# Altium schematic sheet Microcontroller.SchDoc
size A4; SheetNumber: 2; SheetTotal: 5
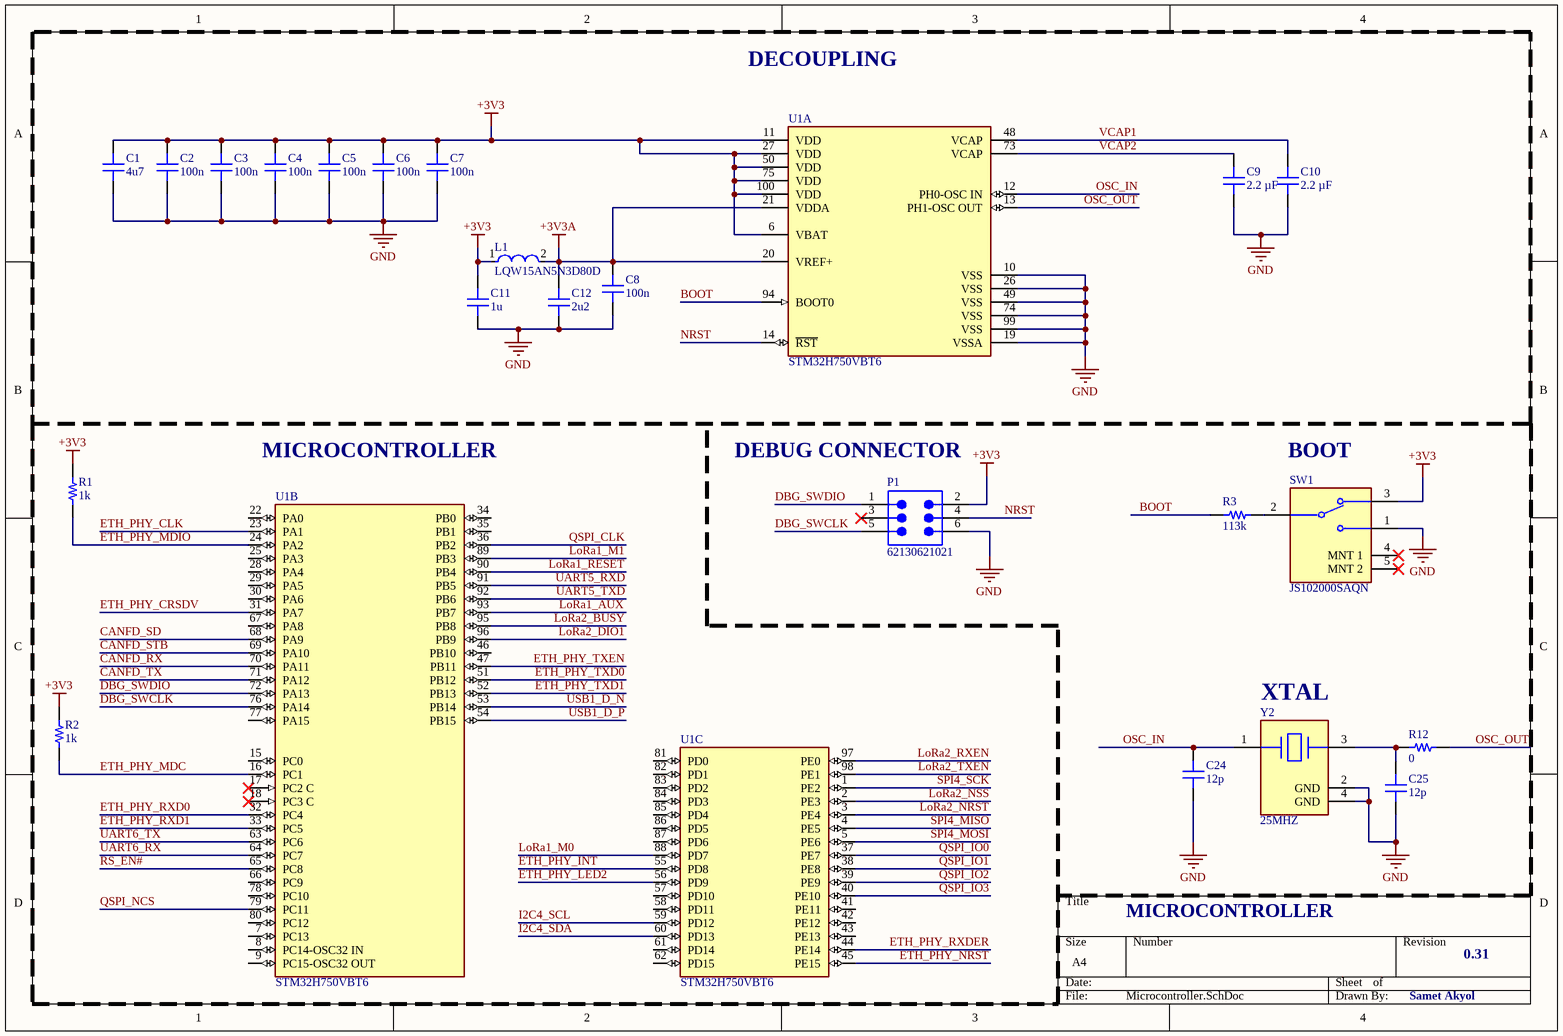
[diagram p0: Microcontroller.SchDoc]

## Parts
C1  4u7  [CAP 0402_1005]
C2  100n  [CAP 0402_1005]
C3  100n  [CAP 0402_1005]
C4  100n  [CAP 0402_1005]
C5  100n  [CAP 0402_1005]
C6  100n  [CAP 0402_1005]
C7  100n  [CAP 0402_1005]
C8  100n  [CAP 0402_1005]
C9  2.2 µF  [CAP 0402_1005]
C10  2.2 µF  [CAP 0402_1005]
C11  1u  [CAP 0402_1005]
C12  2u2  [CAP 0402_1005]
C24  12p  [CAP 0402_1005]
C25  12p  [CAP 0402_1005]
L1  LQW15AN5N3D80D  [FP-LQW15AN_80-MFG]
P1  62130621021  [62130621021]
R1  1k  [RES 0402_1005]
R2  1k  [RES 0402_1005]
R3  113k  [RES 0402_1005]
R12  0  [RES 0402_1005]
SW1  JS102000SAQN  [FP-JS102000SAQN-MFG]
U1  STM32H750VBT6  [FP-LQFP100-1L-MFG]  (parts A,B,C of 3)
Y2  25MHZ  [FP-ABM8G-MFG]

## Blocks framed on the sheet
DECOUPLING: C1-C12 L1 U1

## Nets
+3V3: C1.2 C2.2 C3.2 C4.2 C5.2 C6.2 C7.2 C11.2 L1.1 P1.2 R1.1 R2.1 SW1.3 U1.6(VBAT) U1.11(VDD) U1.27(VDD) U1.50(VDD) U1.75(VDD) U1.100(VDD)
+3V3A: C8.2 C12.2 L1.2 U1.20(VREF+) U1.21(VDDA)
GND: C1.1 C2.1 C3.1 C4.1 C5.1 C6.1 C7.1 C8.1 C9.1 C10.1 C11.1 C12.1 C24.1 C25.1 P1.6 SW1.1 U1.10(VSS) U1.19(VSSA) U1.26(VSS) U1.49(VSS) U1.74(VSS) U1.99(VSS) Y2.2(GND) Y2.4(GND)
BOOT: R3.2 U1.94(BOOT0)
CANFD_RX: U1.70(PA11)
CANFD_SD: U1.68(PA9)
CANFD_STB: U1.69(PA10)
CANFD_TX: U1.71(PA12)
DBG_SWCLK: P1.5 U1.76(PA14)
DBG_SWDIO: P1.1 U1.72(PA13)
ETH_PHY_CLK: U1.23(PA1)
ETH_PHY_CRSDV: U1.31(PA7)
ETH_PHY_INT: U1.55(PD8)
ETH_PHY_LED2: U1.56(PD9)
ETH_PHY_MDC: R2.2 U1.16(PC1)
ETH_PHY_MDIO: R1.2 U1.24(PA2)
ETH_PHY_NRST: U1.45(PE15)
ETH_PHY_RXD0: U1.32(PC4)
ETH_PHY_RXD1: U1.33(PC5)
ETH_PHY_RXDER: U1.44(PE14)
ETH_PHY_TXD0: U1.51(PB12)
ETH_PHY_TXD1: U1.52(PB13)
ETH_PHY_TXEN: U1.47(PB11)
I2C4_SCL: U1.59(PD12)
I2C4_SDA: U1.60(PD13)
LoRa1_AUX: U1.93(PB7)
LoRa1_M0: U1.88(PD7)
LoRa1_M1: U1.89(PB3)
LoRa1_RESET: U1.90(PB4)
LoRa2_BUSY: U1.95(PB8)
LoRa2_DIO1: U1.96(PB9)
LoRa2_NRST: U1.3(PE4)
LoRa2_NSS: U1.2(PE3)
LoRa2_RXEN: U1.97(PE0)
LoRa2_TXEN: U1.98(PE1)
NRST: P1.4 U1.14(~{RST})
OSC_IN: C24.2 U1.12(PH0-OSC_IN) Y2.1
OSC_OUT: R12.1 U1.13(PH1-OSC_OUT)
QSPI_CLK: U1.36(PB2)
QSPI_IO0: U1.37(PE7)
QSPI_IO1: U1.38(PE8)
QSPI_IO2: U1.39(PE9)
QSPI_IO3: U1.40(PE10)
QSPI_NCS: U1.79(PC11)
RS_EN#: U1.65(PC8)
SPI4_MISO: U1.4(PE5)
SPI4_MOSI: U1.5(PE6)
SPI4_SCK: U1.1(PE2)
UART5_RXD: U1.91(PB5)
UART5_TXD: U1.92(PB6)
UART6_RX: U1.64(PC7)
UART6_TX: U1.63(PC6)
USB1_D_N: U1.53(PB14)
USB1_D_P: U1.54(PB15)
VCAP1: C10.2 U1.48(VCAP)
VCAP2: C9.2 U1.73(VCAP)
NetC25_2: C25.2 R12.2 Y2.3
NetR3_1: R3.1 SW1.2(C)

Not connected (* = marked no-connect by the designer): P1 3*; SW1 4(MNT_1)* 5(MNT_2)*; U1 7(PC13) 8(PC14-OSC32_IN) 9(PC15-OSC32_OUT) 15(PC0) 17(PC2_C)* 18(PC3_C)* 22(PA0) 25(PA3) 28(PA4) 29(PA5) 30(PA6) 34(PB0) 35(PB1) 41(PE11) 42(PE12) 43(PE13) 46(PB10) 57(PD10) 58(PD11) 61(PD14) 62(PD15) 66(PC9) 67(PA8) 77(PA15) 78(PC10) 80(PC12) 81(PD0) 82(PD1) 83(PD2) 84(PD3) 85(PD4) 86(PD5) 87(PD6)

## Notes on the sheet
- MICROCONTROLLER
- (near P1) DEBUG CONNECTOR
- (near SW1) BOOT
- (near Y2) XTAL
- 0.31
- Samet Akyol

## Library data of the parts
C1-C8 C11 C12 C24 C25 = CL05B104KP5VPNC: CAP CER 100NF 10V X7R 0402; manufacturer: Samsung Electro-Mechanics; Capacitance: 0.1 µF; Tolerance: ±10%; Part Number: CL05B104KP5VPNC; Applications: Automotive; componentlink1description: Datasheet; componentlink1url: https://mm.digikey.com/Volume0/opasdata/d220001/medias/docus/5458/CL05B104KP5VPNC_Spec.pdf; componentlink2description: DigiKey Link; componentlink2url: https://www.digikey.com/en/products/detail/samsung-electro-mechanics/CL05B104KP5VPNC/20498482; Device Package: 0402 (1005 Metric); lastupdated: 9.02.2024 20:03:17; Lifecycle Status: Active; Minimum Order: 1; Mounting Type: Surface Mount, MLCC; Operating Temperature: -55°C ~ 125°C; Package / Case: 0402 (1005 Metric); packaging: TapeAndReel; partid: 56690; price: 0.01; Ratings: AEC-Q200; series: CL; Size / Dimension: 0.039" L x 0.020" W (1.00mm x 0.50mm); Supplier 1: DigiKey; Supplier Part Number 1: 1276-CL05B104KP5VPNCCT-ND; Temperature Coefficient: X7R; Thickness (Max): 0.022" (0.55mm); Voltage - Rated: 10V
  C1: Value: 4u7
  C2-C8: Value: 100n
  C11: Value: 1u
  C12: Value: 2u2
  C24 C25: Value: 12p
C9 C10 = CL05A225KO5NQNC: CAP CER 2.2UF 16V X5R 0402; manufacturer: Samsung Electro-Mechanics; Tolerance: ±10%; Part Number: CL05A225KO5NQNC; Value: 2.2 µF; Applications: General Purpose; Capacitance: 2.2 µF; componentlink1description: Datasheet; componentlink1url: http://www.samsungsem.com/kr/support/product-search/mlcc/CL05A225KO5NQNC.jsp; componentlink2description: DigiKey Link; componentlink2url: https://www.digikey.com/en/products/detail/samsung-electro-mechanics/CL05A225KO5NQNC/3887119; Device Package: 0402 (1005 Metric); lastupdated: 9.02.2024 20:04:38; Lifecycle Status: Active; Minimum Order: 1; Mounting Type: Surface Mount, MLCC; Operating Temperature: -55°C ~ 85°C; Package / Case: 0402 (1005 Metric); packaging: TapeAndReel; partid: 1761; Part Status: Active; price: 0.03; series: CL; Size / Dimension: 0.039" L x 0.020" W (1.00mm x 0.50mm); Supplier 1: DigiKey; Supplier Part Number 1: 1276-1461-1-ND; Temperature Coefficient: X5R; Thickness (Max): 0.022" (0.55mm); Voltage - Rated: 16V
L1 = CMP-06042-007060-1: Wire Wound RF Inductor 5.3nH ±0.5nH 1770mA 0.04Ω 0402 (1005); Max DC Current: 1.77A; Test Frequency: 100MHz; Q Factor: 35; Shielding: Unshielded; Self Resonant Frequency: 8GHz; Core Material: Non-Magnetic; DC Resistance (DCR): 40mR; Case/Package: 0402; Height - Seated (Max): 0.024inch; Height: 0.5mm; Mount: Surface Mount; Inductance: 5.3nH; Width: 0.5mm; Package Quantity: 1; Packaging: Tape and Reel; Current Rating: 1.77A; Case Code (Metric): 1005; Length: 0.039inch; Case Code (Imperial): 0402; Resistor Type: Wirewound; Max Operating Temperature: 125°C; Termination: SMD/SMT; Min Operating Temperature: -55°C
P1 = CMP-1502-00936-3: NexarPartId: 116077963
R1-R3 R12 = RP73PF1E249KBTD: RES 249K OHM 0.1% 1/10W 0402; Manufacturer: TE Connectivity Passive Product; Power (Watts): 0.1W, 1/10W; Resistance: 249 kOhms; Temperature Coefficient: ±25ppm/°C; Part Number: RP73PF1E249KBTD; ComponentLink1Description: Datasheet; ComponentLink1URL: https://www.te.com/commerce/DocumentDelivery/DDEController?Action=srchrtrv&DocNm=1773272&DocType=DS&DocLang=English; ComponentLink2Description: DigiKey Link; ComponentLink2URL: https://www.digikey.com/en/products/detail/te-connectivity-passive-product/RP73PF1E249KBTD/8261091; Composition: Thin Film; Device Package: 0402 (1005 Metric); Height - Seated (Max): 0.014" (0.35mm); LastUpdated: 9.02.2024 20:30:24; Lifecycle Status: Active; Minimum Order: 1; Number of Terminations: 2; Operating Temperature: -55°C ~ 155°C; Package / Case: 0402 (1005 Metric); Packaging: TapeAndReel; PartId: 2418; Part Status: Active; Price: 0.07; Series: RP73, Holsworthy; Size / Dimension: 0.039" L x 0.020" W (1.00mm x 0.50mm); Supplier 1: DigiKey; Supplier Part Number 1: A127549CT-ND; Supplier Device Package: 0402; Tolerance: ±0.1%
  R1 R2: Value: 1k
  R3: Value: 113k
  R12: Value: 0
SW1 = CMP-10038-000025-1: SWITCH SLIDE SPDT 1MA 5V; Actuator Material: Nylon; Contact Resistance: 70mR; Electrical Life: 15000Cycles; Actuator Length: 1.5mm; Switch Function: On-On; Actuator Type: Standard; Actuator Color: Black; Current Rating: 1mA; Throw Configuration: SPDT; Termination: Gull Wing; Housing Material: Nylon; Max Operating Temperature: 85°C; Max Voltage Rating (DC): 5V; Voltage Rating (DC): 5V; Contact Plating: Silver; Radiation Hardening: No; Package Quantity: 1; REACH SVHC: No SVHC; RoHS Compliant: Yes; Orientation: Right Angle; Max Current Rating: 1mA; Case/Package: SMD/SMT; Contact Current Rating: 1mA; Contact Material: Copper Alloy; Mount: Surface Mount; Flammability Rating: UL94 V-2; Packaging: Tape and Reel; Switch Travel: 1.5mm; Length: 7.8mm; Series: JS; Min Operating Temperature: -20°C; Depth: 4.82mm
U1 = CMP-12105-000017-1: IC MCU 32BIT 128KB FLASH 100LQFP; Manufacturer: STMicroelectronics; Number Of Uart Channels: 9; Number Of I/Os: 82; Max Junction Temp: +125°C; Data Bus Width: 32bits; Ram Size: 1MBytes; Min Supply Voltage: 1.62V; Number Of Spi Channels: 6; Number Of Adc Channels: 36; Max Supply Voltage: 3.6V; Standoff Height: 0.05mm; Interface: I2C,SPI,UART,USART,CAN,USB,LIN,IrDA,Ethernet,I2S,Other; Number Of A/D Converters: 3; Number Of I2C Channels: 4; Memory Size: 128KBytes; Frequency: 480MHz; Number Of Timers/Counters: 20; Number Of Ethernet Channels: 1; Core Architecture: ARM Cortex-M7; Number Of Usb Channels: 2; Number Of Pwm Channels: 42; Ambient Temperature Range High: +85°C; Temperature: -40°C to +125°C; ComponentLink2URL: https://www.st.com/resource/en/datasheet/stm32h750vb.pdf; Device Class L2: Embedded Processors and Controllers; Temperature Range Low: -40°C; Octopart: https://octopart.com/stm32h750vbt6-stmicroelectronics-94048547; Category: IC; Manufacturer Part Number: STM32H750VBT6; Height: 1.6mm; Lead Free: Yes; Device Class L1: Integrated Circuits (ICs); Digikey Description: IC MCU 32BIT 128KB FLASH 100LQFP; RoHS: TRUE; Ambient Temperature Range Low: -40°C; Device Class L3: Microcontrollers; ComponentLink2Description: Datasheet; Mouser Description: MCU 32-Bit STM32H750VB ARM Cortex M7 RISC 128KB Flash 1.8V/2.5V/3.3V 100-Pin LQFP Tray; Number Of Cores: 1; Automotive: No; Memory Type: FLASH; Package: LQFP100-1L; Temperature Range High: +125°C
Y2 = CMP-2000-05733-3: Crystal 25MHz ±20ppm (Tol) ±30ppm (Stability) 18pF FUND 60Ω 4-Pin SMD T/R; Series Resistance: 60R; Length: 3.2mm; Depth: 2.5mm; Packaging: Tape and Reel; Min Operating Temperature: -40°C; Operating Frequency: 25 MHz; Lead Free: Lead Free; Number of Pins: 4; Frequency Tolerance: 20ppm; Radiation Hardening: No; Max Operating Temperature: 85°C; Termination: SMD/SMT; Frequency Stability: 30ppm; Frequency: 25MHz; Series: ABM8G; Mount: Surface Mount; Package Quantity: 1000; Height: 0.039inch; Width: 0.098inch; Case/Package: CSMD; ESR (Equivalent Series Resistance): 60R; Load Capacitance: 18pF; Tolerance: 20ppm